# Altium schematic sheet eMMC.SchDoc
size 420 x 297 mm; SheetNumber: 11; SheetTotal: 23
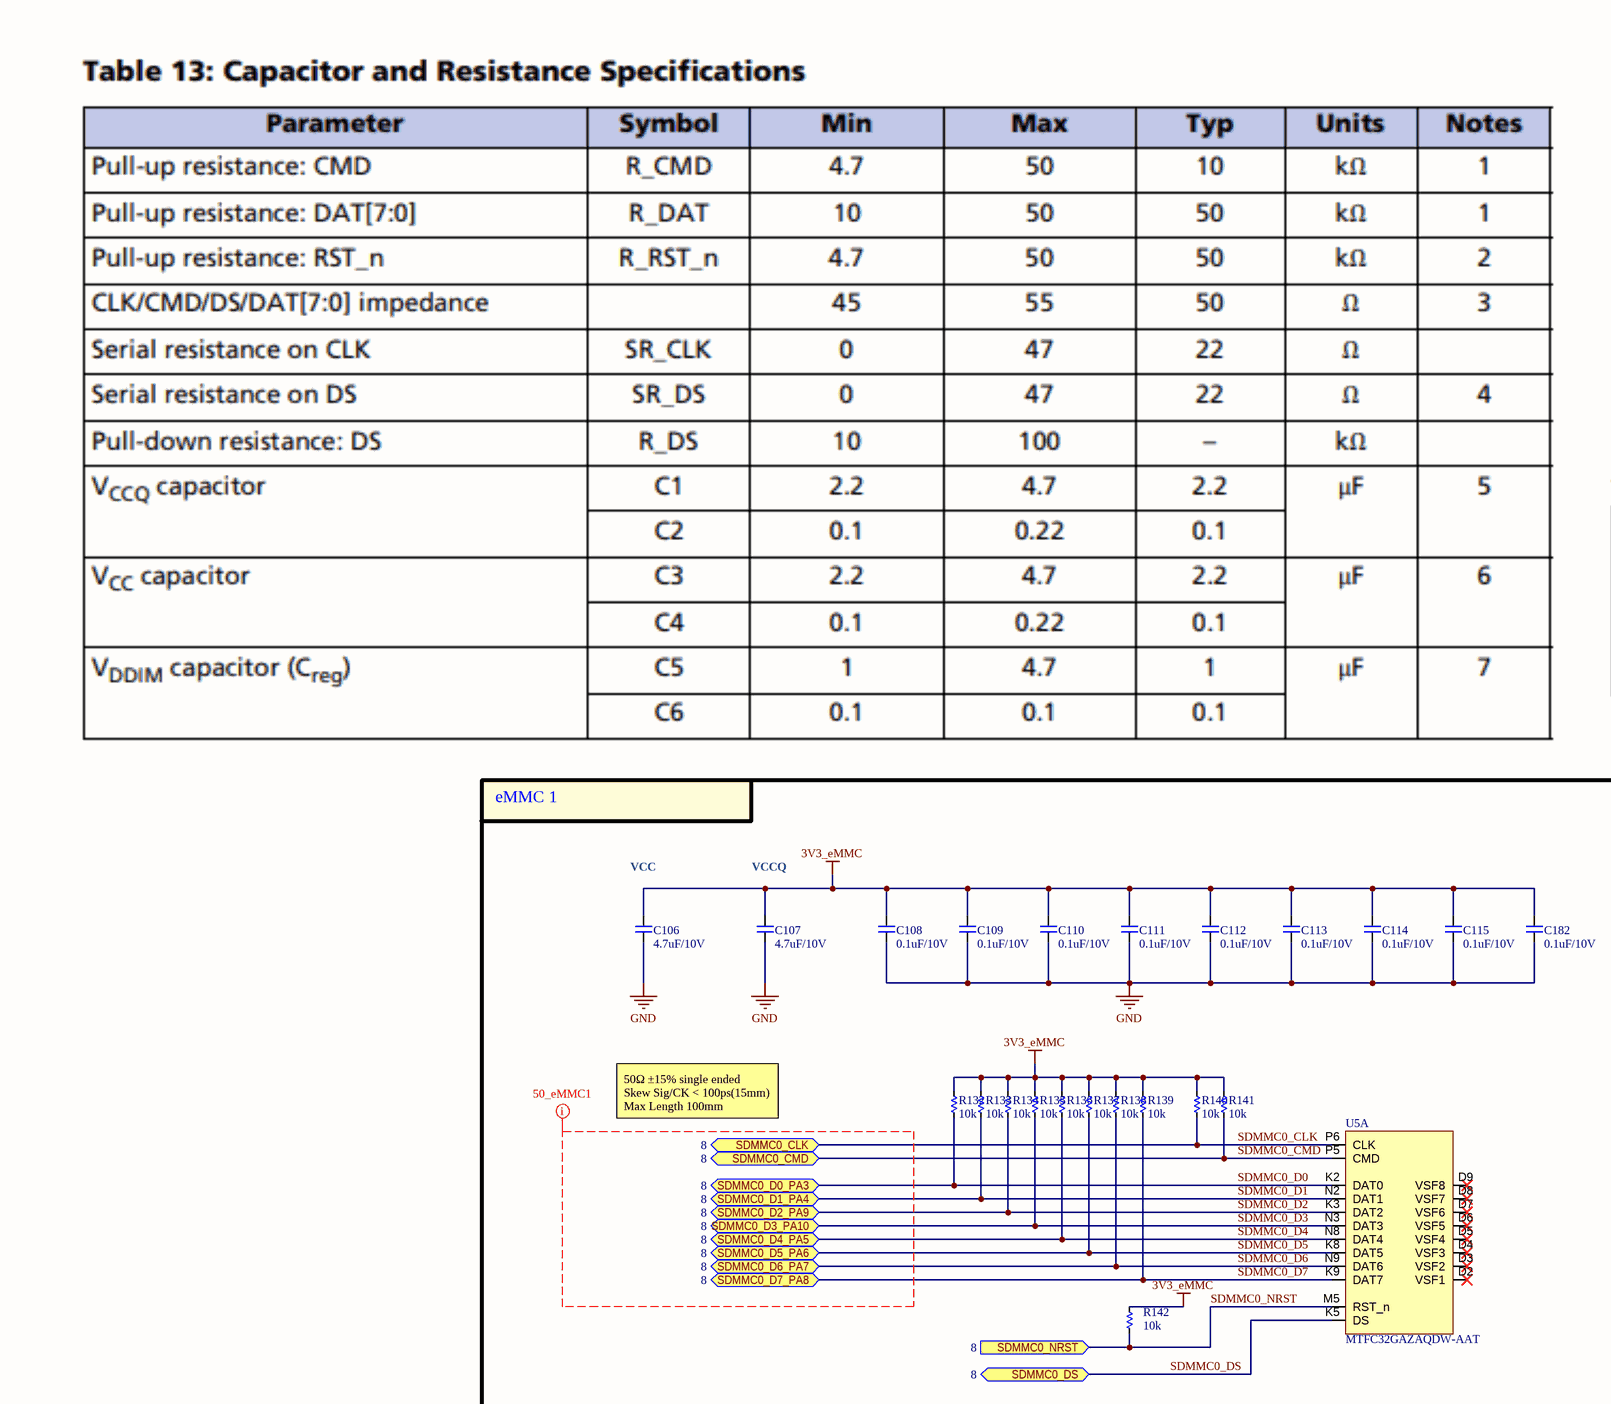
[diagram p0: eMMC.SchDoc, top left]
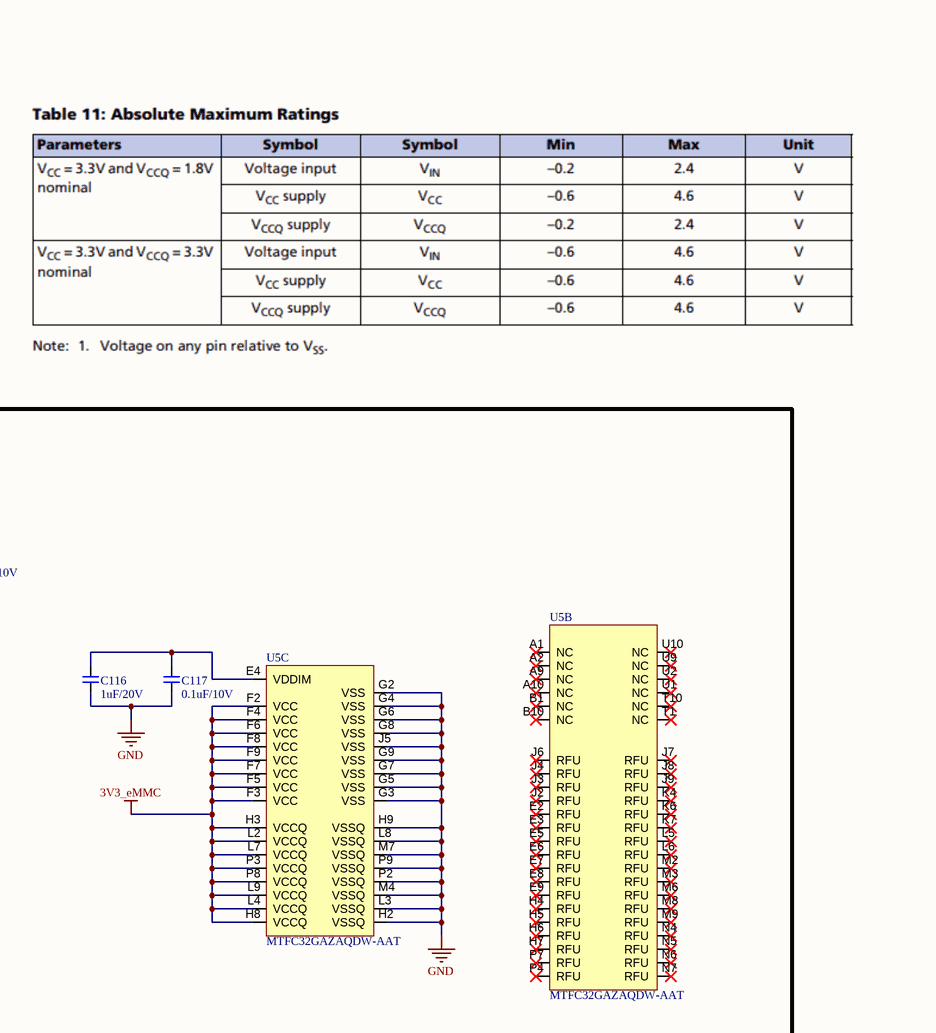
[diagram p1: eMMC.SchDoc, top middle]
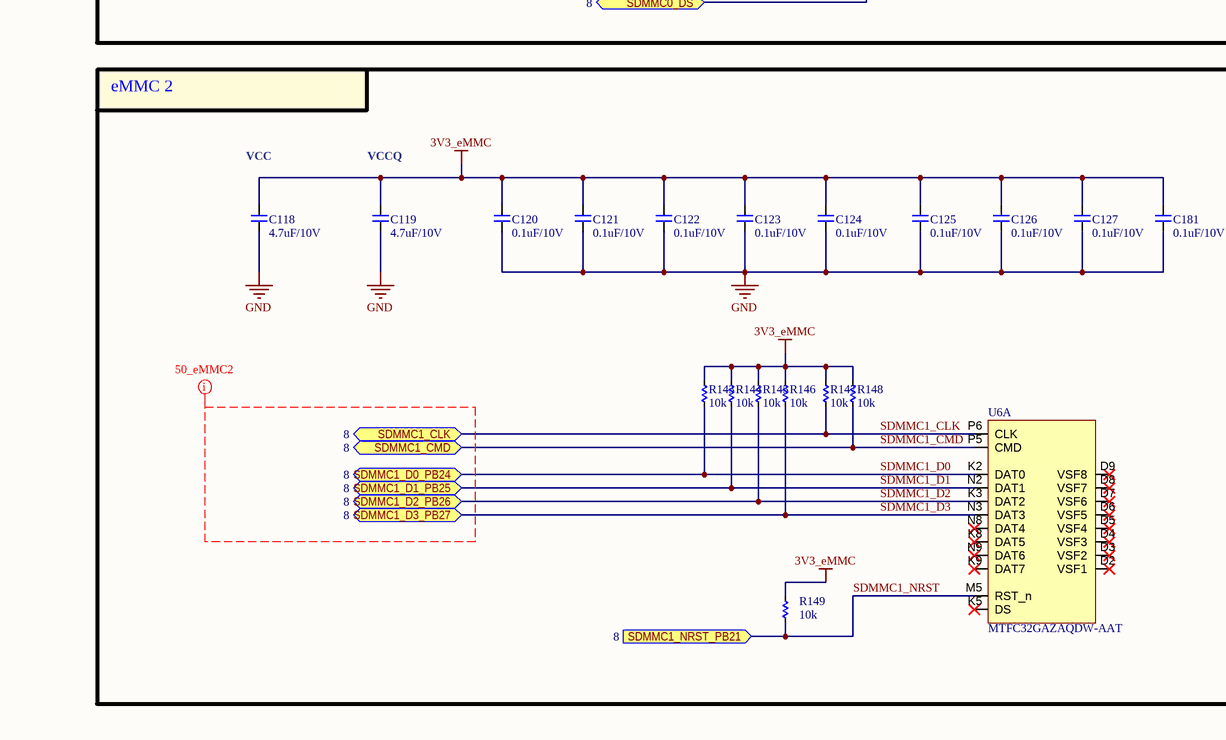
[diagram p2: eMMC.SchDoc, bottom left]
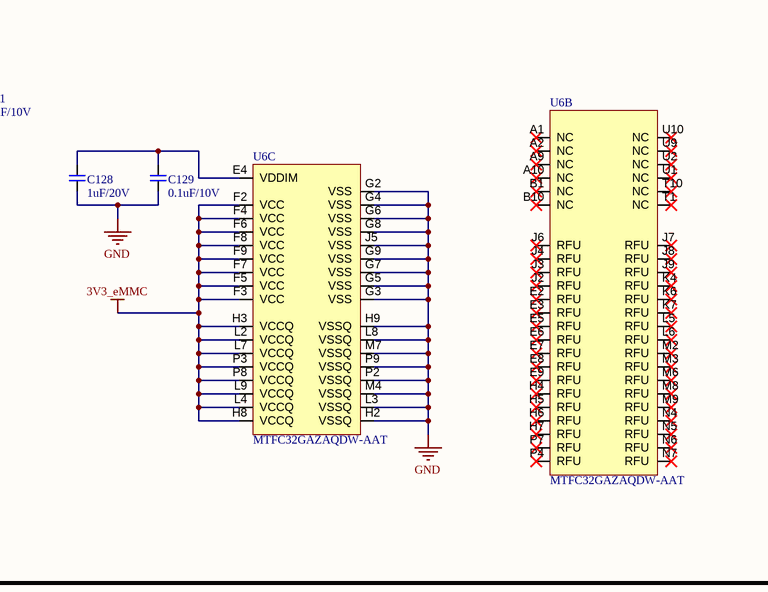
[diagram p3: eMMC.SchDoc, bottom middle]
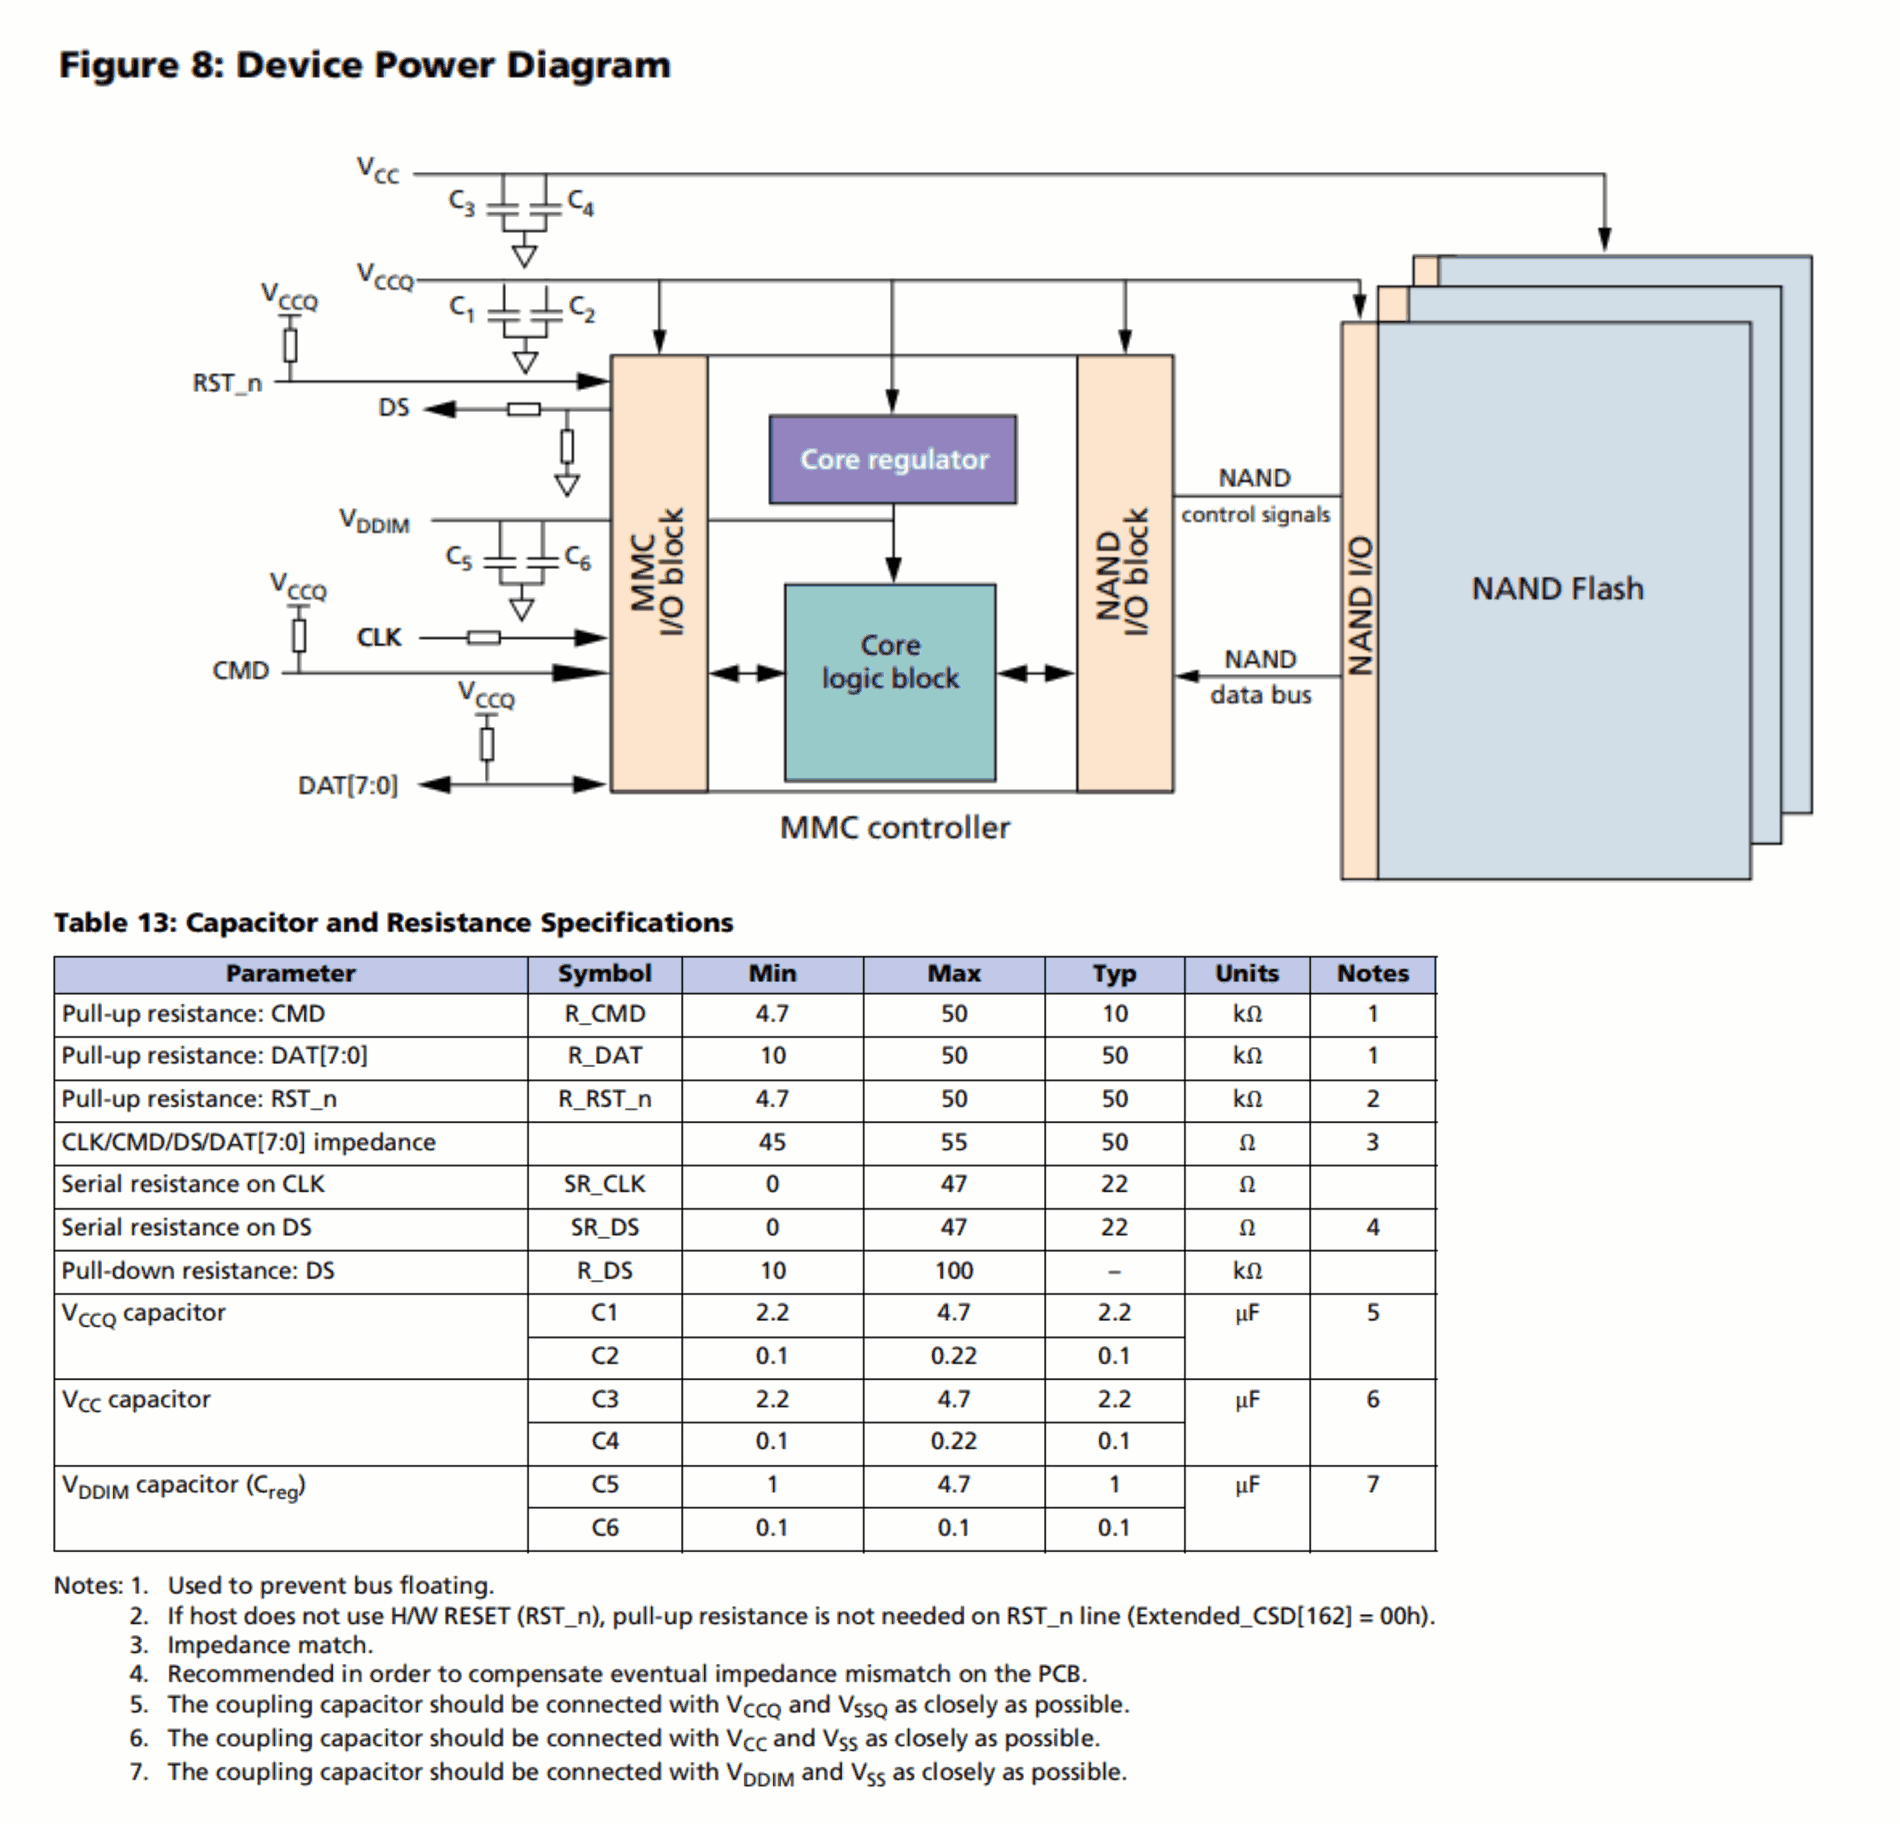
[diagram p4: eMMC.SchDoc, bottom right]

## Parts
C106  4.7uF/10V  [CAP_C_1005X50_L]
C107  4.7uF/10V  [CAP_C_1005X50_L]
C108  0.1uF/10V  [CAP_C_1005X50_L]
C109  0.1uF/10V  [CAP_C_1005X50_L]
C110  0.1uF/10V  [CAP_C_1005X50_L]
C111  0.1uF/10V  [CAP_C_1005X50_L]
C112  0.1uF/10V  [CAP_C_1005X50_L]
C113  0.1uF/10V  [CAP_C_1005X50_L]
C114  0.1uF/10V  [CAP_C_1005X50_L]
C115  0.1uF/10V  [CAP_C_1005X50_L]
C116  1uF/20V  [CAP_C_1005X50_L]
C117  0.1uF/10V  [CAP_C_1005X50_L]
C118  4.7uF/10V  [CAP_C_1005X50_L]
C119  4.7uF/10V  [CAP_C_1005X50_L]
C120  0.1uF/10V  [CAP_C_1005X50_L]
C121  0.1uF/10V  [CAP_C_1005X50_L]
C122  0.1uF/10V  [CAP_C_1005X50_L]
C123  0.1uF/10V  [CAP_C_1005X50_L]
C124  0.1uF/10V  [CAP_C_1005X50_L]
C125  0.1uF/10V  [CAP_C_1005X50_L]
C126  0.1uF/10V  [CAP_C_1005X50_L]
C127  0.1uF/10V  [CAP_C_1005X50_L]
C128  1uF/20V  [CAP_C_1005X50_L]
C129  0.1uF/10V  [CAP_C_1005X50_L]
C181  0.1uF/10V  [CAP_C_1005X50_L]
C182  0.1uF/10V  [CAP_C_1005X50_L]
R132  10k  [RES_C_1005x30_L]
R133  10k  [RES_C_1005x30_L]
R134  10k  [RES_C_1005x30_L]
R135  10k  [RES_C_1005x30_L]
R136  10k  [RES_C_1005x30_L]
R137  10k  [RES_C_1005x30_L]
R138  10k  [RES_C_1005x30_L]
R139  10k  [RES_C_1005x30_L]
R140  10k  [RES_C_1005x30_L]
R141  10k  [RES_C_1005x30_L]
R142  10k  [RES_C_1005x30_L]
R143  10k  [RES_C_1005x30_L]
R144  10k  [RES_C_1005x30_L]
R145  10k  [RES_C_1005x30_L]
R146  10k  [RES_C_1005x30_L]
R147  10k  [RES_C_1005x30_L]
R148  10k  [RES_C_1005x30_L]
R149  10k  [RES_C_1005x30_L]
U5  MTFC32GAZAQDW-AAT  [BGA_100_C_100P_10X17_1400X1800X150]  (parts A,B,C of 3)
U6  MTFC32GAZAQDW-AAT  [BGA_100_C_100P_10X17_1400X1800X150]  (parts A,B,C of 3)

## Blocks framed on the sheet
eMMC 1: C106-C117 C182 R132-R142 U5
eMMC 2: C118-C129 C181 R143-R149 U6

## Ports
SDMMC0_CLK (bidir, see 8), SDMMC0_CMD (bidir, see 8), SDMMC0_D0_PA3 (bidir, see 8), SDMMC0_D1_PA4 (bidir, see 8), SDMMC0_D2_PA9 (bidir, see 8), SDMMC0_D3_PA10 (bidir, see 8), SDMMC0_D4_PA5 (bidir, see 8), SDMMC0_D5_PA6 (bidir, see 8), SDMMC0_D6_PA7 (bidir, see 8), SDMMC0_D7_PA8 (bidir, see 8), SDMMC0_DS (bidir, see 8), SDMMC0_NRST (in, see 8), SDMMC1_CLK (bidir, see 8), SDMMC1_CMD (bidir, see 8), SDMMC1_D0_PB24 (bidir, see 8), SDMMC1_D1_PB25 (bidir, see 8), SDMMC1_D2_PB26 (bidir, see 8), SDMMC1_D3_PB27 (bidir, see 8), SDMMC1_NRST_PB21 (in, see 8)

## Nets
3V3_eMMC: C106.2 C107.2 C108.2 C109.2 C110.2 C111.2 C112.2 C113.2 C114.2 C115.2 C118.2 C119.2 C120.2 C121.2 C122.2 C123.2 C124.2 C125.2 C126.2 C127.2 C181.2 C182.2 R132.1 R133.1 R134.1 R135.1 R136.1 R137.1 R138.1 R139.1 R140.1 R141.1 R142.1 R143.1 R144.1 R145.1 R146.1 R147.1 R148.1 R149.1 U5.F2(VCC) U5.F3(VCC) U5.F4(VCC) U5.F5(VCC) U5.F6(VCC) U5.F7(VCC) U5.F8(VCC) U5.F9(VCC) U5.H3(VCCQ) U5.H8(VCCQ) U5.L2(VCCQ) U5.L4(VCCQ) U5.L7(VCCQ) U5.L9(VCCQ) U5.P3(VCCQ) U5.P8(VCCQ) U6.F2(VCC) U6.F3(VCC) U6.F4(VCC) U6.F5(VCC) U6.F6(VCC) U6.F7(VCC) U6.F8(VCC) U6.F9(VCC) U6.H3(VCCQ) U6.H8(VCCQ) U6.L2(VCCQ) U6.L4(VCCQ) U6.L7(VCCQ) U6.L9(VCCQ) U6.P3(VCCQ) U6.P8(VCCQ)
GND: C106.1 C107.1 C108.1 C109.1 C110.1 C111.1 C112.1 C113.1 C114.1 C115.1 C116.1 C117.1 C118.1 C119.1 C120.1 C121.1 C122.1 C123.1 C124.1 C125.1 C126.1 C127.1 C128.1 C129.1 C181.1 C182.1 U5.G2(VSS) U5.G3(VSS) U5.G4(VSS) U5.G5(VSS) U5.G6(VSS) U5.G7(VSS) U5.G8(VSS) U5.G9(VSS) U5.H2(VSSQ) U5.H9(VSSQ) U5.J5(VSS) U5.L3(VSSQ) U5.L8(VSSQ) U5.M4(VSSQ) U5.M7(VSSQ) U5.P2(VSSQ) U5.P9(VSSQ) U6.G2(VSS) U6.G3(VSS) U6.G4(VSS) U6.G5(VSS) U6.G6(VSS) U6.G7(VSS) U6.G8(VSS) U6.G9(VSS) U6.H2(VSSQ) U6.H9(VSSQ) U6.J5(VSS) U6.L3(VSSQ) U6.L8(VSSQ) U6.M4(VSSQ) U6.M7(VSSQ) U6.P2(VSSQ) U6.P9(VSSQ)
SDMMC0_CLK: R140.2 U5.P6(CLK) ; port SDMMC0_CLK
SDMMC0_CMD: R141.2 U5.P5(CMD) ; port SDMMC0_CMD
SDMMC0_D0: R132.2 U5.K2(DAT0) ; port SDMMC0_D0_PA3
SDMMC0_D1: R133.2 U5.N2(DAT1) ; port SDMMC0_D1_PA4
SDMMC0_D2: R134.2 U5.K3(DAT2) ; port SDMMC0_D2_PA9
SDMMC0_D3: R135.2 U5.N3(DAT3) ; port SDMMC0_D3_PA10
SDMMC0_D4: R136.2 U5.N8(DAT4) ; port SDMMC0_D4_PA5
SDMMC0_D5: R137.2 U5.K8(DAT5) ; port SDMMC0_D5_PA6
SDMMC0_D6: R138.2 U5.N9(DAT6) ; port SDMMC0_D6_PA7
SDMMC0_D7: R139.2 U5.K9(DAT7) ; port SDMMC0_D7_PA8
SDMMC0_DS: U5.K5(DS) ; port SDMMC0_DS
SDMMC0_NRST: R142.2 U5.M5(RST_n) ; port SDMMC0_NRST
SDMMC1_CLK: R147.2 U6.P6(CLK) ; port SDMMC1_CLK
SDMMC1_CMD: R148.2 U6.P5(CMD) ; port SDMMC1_CMD
SDMMC1_D0: R143.2 U6.K2(DAT0) ; port SDMMC1_D0_PB24
SDMMC1_D1: R144.2 U6.N2(DAT1) ; port SDMMC1_D1_PB25
SDMMC1_D2: R145.2 U6.K3(DAT2) ; port SDMMC1_D2_PB26
SDMMC1_D3: R146.2 U6.N3(DAT3) ; port SDMMC1_D3_PB27
SDMMC1_NRST: R149.2 U6.M5(RST_n) ; port SDMMC1_NRST_PB21
NetC116_2: C116.2 C117.2 U5.E4(VDDIM)
NetC128_2: C128.2 C129.2 U6.E4(VDDIM)

Not connected (* = marked no-connect by the designer): U5 A1(NC)* A2(NC)* A9(NC)* A10(NC)* B1(NC)* B10(NC)* D2(VSF1)* D3(VSF2)* D4(VSF3)* D5(VSF4)* D6(VSF5)* D7(VSF6)* D8(VSF7)* D9(VSF8)* E2(RFU)* E3(RFU)* E5(RFU)* E6(RFU)* E7(RFU)* E8(RFU)* E9(RFU)* H4(RFU)* H5(RFU)* H6(RFU)* H7(RFU)* J2(RFU)* J3(RFU)* J4(RFU)* J6(RFU)* J7(RFU)* J8(RFU)* J9(RFU)* K4(RFU)* K6(RFU)* K7(RFU)* L5(RFU)* L6(RFU)* M2(RFU)* M3(RFU)* M6(RFU)* M8(RFU)* M9(RFU)* N4(RFU)* N5(RFU)* N6(RFU)* N7(RFU)* P4(RFU)* P7(RFU)* T1(NC)* T10(NC)* U1(NC)* U2(NC)* U9(NC)* U10(NC)*; U6 A1(NC)* A2(NC)* A9(NC)* A10(NC)* B1(NC)* B10(NC)* D2(VSF1)* D3(VSF2)* D4(VSF3)* D5(VSF4)* D6(VSF5)* D7(VSF6)* D8(VSF7)* D9(VSF8)* E2(RFU)* E3(RFU)* E5(RFU)* E6(RFU)* E7(RFU)* E8(RFU)* E9(RFU)* H4(RFU)* H5(RFU)* H6(RFU)* H7(RFU)* J2(RFU)* J3(RFU)* J4(RFU)* J6(RFU)* J7(RFU)* J8(RFU)* J9(RFU)* K4(RFU)* K5(DS)* K6(RFU)* K7(RFU)* K8(DAT5)* K9(DAT7)* L5(RFU)* L6(RFU)* M2(RFU)* M3(RFU)* M6(RFU)* M8(RFU)* M9(RFU)* N4(RFU)* N5(RFU)* N6(RFU)* N7(RFU)* N8(DAT4)* N9(DAT6)* P4(RFU)* P7(RFU)* T1(NC)* T10(NC)* U1(NC)* U2(NC)* U9(NC)* U10(NC)*

## Layout directives
net class 50_eMMC1: (no net found under the mark)
net class 50_eMMC2: (no net found under the mark)

## Notes on the sheet
- (near C106) VCC
- (near C107) VCCQ
- 50Ω ±15% single ended
  Skew Sig/CK < 100ps(15mm)
  Max Length 100mm
- (near C118) VCC
- (near C119) VCCQ
- Project:
- BEE-1012
- Sub-system:
- SATELLITE_EXP_CONTROLLER
- Design by:
- SANG HUYNH
- BAO BUI
- Sheet title:
- Sheet
- A3
- of
- Checked by:
- Approved by:
- VU PHAM
- Revision:
- Document No:
- Size:
- Date:

## Library data of the parts
C106-C129 C181 C182 = _CAP_C_2: CAP CHIP
R132-R149 = _RES_B_2: RES